# Altium project HTPCB.PrjPcb
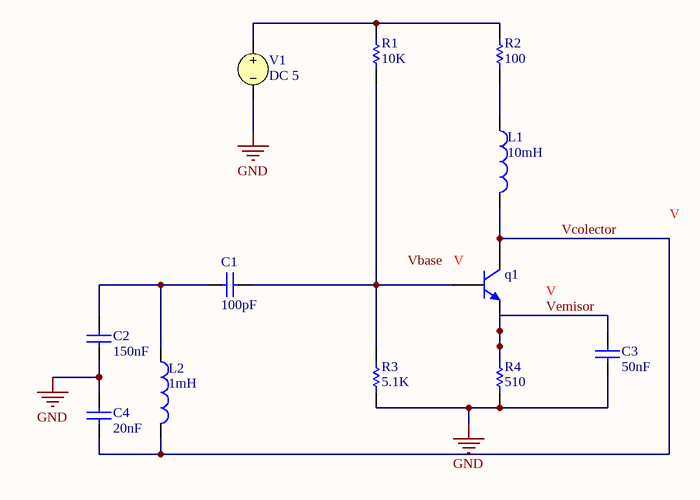
[diagram p0: DC.SchDoc]
Author: Diego Terraza; Carnet: 21601; Curso: IE3028; Revision: 1.0
13 sheets, 88 parts. Net scope: global (net labels, ports and power ports of the same name join across sheets).
Board file: Pruebapcb.PcbDoc
Sheets:
  DC.SchDoc
  Transitorio.SchDoc
  HTDC.SchDoc
  HTtransitorio.SchDoc
  HTparametros.SchDoc
  Barrido_1fuente.SchDoc
  Barrido2fuentes.SchDoc
  AnalisisAC.SchDoc
  FourierHT.SchDoc
  WorstCaseHT.SchDoc
  Barridotemp.SchDoc
  polosyzeros.SchDoc
  Pruebaesquem.SchDoc

## Sheet DC.SchDoc
size Letter; Author: Diego Terraza; Revision: 1.0; SheetNumber: 1; SheetTotal: 2; Curso: IE3028; Carnet: 21601

### Parts
C1  value 100pF  (hidden comment: Capacitor)
C2  value 150nF  (hidden comment: Capacitor)
C3  value 50nF  (hidden comment: Capacitor)
C4  value 20nF  (hidden comment: Capacitor)
L1  value 10mH  (hidden comment: Inductor)
L2  value 1mH  (hidden comment: Inductor)
q1  Bipolar NPN 3 Pins Transistor VBIC Model  (value not drawn)
R1  value 10K  (hidden comment: Resistor)
R2  value 100  (hidden comment: Resistor)
R3  value 5.1K  (hidden comment: Resistor)
R4  value 510  (hidden comment: Resistor)
V1  DC 5

### Nets
GND: C2.2 C3.2 C4.1 R3.2 R4.2 V1.2
Vcolector: C4.2 L1.2 L2.2 q1.1(C)
Vemisor: C3.1 q1.3(E) R4.1
NetC1_1: C1.1 q1.2(B) R1.2 R3.1
NetC1_2: C1.2 C2.1 L2.1
NetL1_1: L1.1 R2.2
NetR1_1: R1.1 R2.1 V1.1

### Notes on the sheet
- Labels drawn without touching a wire or pin: Vbase
- Text
- Proyecto:
- Documento:
- Autor:
- Carnet:
- Fecha:
- Revisión:
- Curso:
- Tamaño:
- Hoja:
- de
- Carta

### Library data of the parts
C1-C4 = Capacitor: SimulationGenericComponent: True
L1 L2 = Inductor: SimulationGenericComponent: True
q1 = BJT NPN VBIC: SimulationGenericComponent: True; AFN: 1; AJC: -0.5; ART: 0.1; AVC1: 0; EA: 1.12; FC: 0.9; IBBE: 1e-06; IBCI: 1e-16; IBEI: 1e-18; MC: 0.33; NCN: 2; NKF: 0.5; PC: 0.75; TNOM: 27; VERS: 1.2; XII: 3; AJE: -0.5; AJS: -0.5; AVC2: 0; BFN: 1; CBCO: 0; CBEO: 0; CCSO: 0; CJC: 0; CJCP: 0; CJE: 0; CJEP: 0; CTH: 0; DEAR: 0; EAIC: 1.12; EAIE: 1.12; EAIS: 1.12; EANC: 1.12; EANE: 1.12; EANS: 1.12; EAP: 1.12; EBBE: 0; GAMM: 0; HRCF: 1; IBCIP: 0; IBCN: 0; IBCNP: 0; IBEIP: 0; IBEN: 0; IBENP: 0; IKF: 0; IKP: 0; IKR: 0; IS: 1e-16; ISP: 0; ISRR: 1; ITF: 0; KFN: 0; ME: 0.33; MS: 0.33; NBBE: 1; NCI: 1; NCIP: 1; NCNP: 2; NEI: 1; NEN: 2; NF: 1; NFP: 1; NR: 1; PE: 0.75; PS: 0.75; QBM: 0; QCO: 0; QTF: 0; RBI: 0.1; RBP: 0.1; RBX: 0; RCI: 0.1; RCX: 0; RE: 0; RS: 0; RTH: 0; TAVC: 0; TD: 0; TF: 0; TNBBE: 0; TNF: 0; TR: 0; TVBBE1: 0; TVBBE2: 0; VBBE: 0; VEF: 0; VER: 0; VO: 0; VREF: 0; VRT: 0; VTF: 0; WBE: 1; WSP: 1; XIKF: 0; XIN: 3; XIS: 3; XISR: 0; XRBI: 0; XRBP: 0; XRBX: 0; XRCI: 0; XRCX: 0; XRE: 0; XRS: 0; XTF: 0; XVO: 0
R1-R4 = Resistor: TC1: 0; SimulationGenericComponent: True; TC2: 0
V1 = VSRC: Voltage Source; Note: PCB Footprint - Not required; AC Magnitude: 1; AC Phase: 0; Value: 5; Published: 8-Jun-2000; LatestRevisionDate: 17-Jul-2002; LatestRevisionNote: Re-released for DXP Platform.; PackageReference: Not Applicable; Publisher: Altium Limited

## Sheet Transitorio.SchDoc
size Letter; SheetNumber: 2; SheetTotal: 4
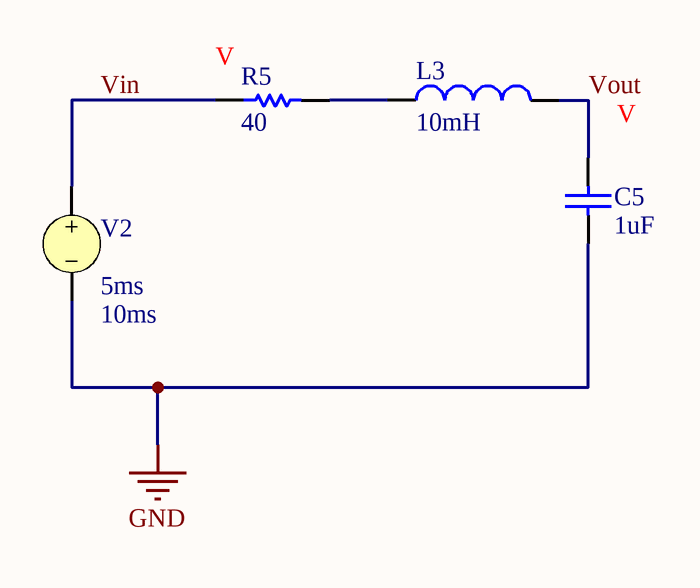
[diagram p1: Transitorio.SchDoc]

### Parts
C5  value 1uF  (hidden comment: Capacitor)
L3  value 10mH  (hidden comment: Inductor)
R5  value 40  (hidden comment: Resistor)
V2  Pulse Width: 5ms  Period: 10ms  (hidden comment: PULSE(0 1 100n 10n 10n 5ms 10ms 0))

### Nets
GND: C5.1 V2.2
Vin: R5.1 V2.1
Vout: C5.2 L3.2
NetL3_1: L3.1 R5.2

### Notes on the sheet
- Proyecto:
- Documento:
- Autor:
- Carnet:
- Fecha:
- Revisión:
- Curso:
- Tamaño:
- Hoja:
- de
- Carta

### Library data of the parts
C5 = Capacitor: SimulationGenericComponent: True
L3 = Inductor: SimulationGenericComponent: True
R5 = Resistor: TC1: 0; SimulationGenericComponent: True; TC2: 0
V2 = VSRC: Voltage Source; Note: PCB Footprint - Not required; AC Magnitude: 1; AC Phase: 0; Published: 8-Jun-2000; LatestRevisionDate: 17-Jul-2002; LatestRevisionNote: Re-released for DXP Platform.; PackageReference: Not Applicable; Publisher: Altium Limited; DC Magnitude: 1; Initial Value: 0; Pulsed Value: 1; Time Delay: 100n; Rise Time: 10n; Fall Time: 10n; Phase: 0

## Sheet HTDC.SchDoc
size Letter; SheetNumber: 3; SheetTotal: 3
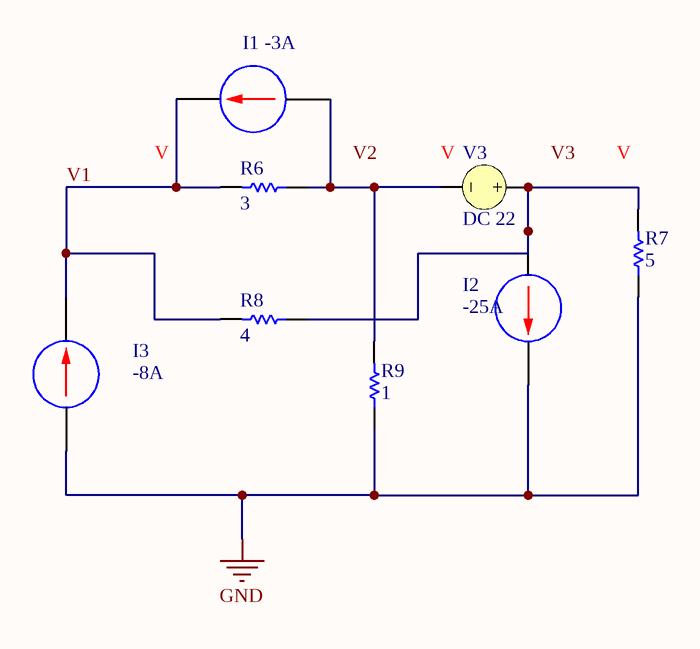
[diagram p2: HTDC.SchDoc]

### Parts
I1  DC: -3A  (hidden comment: DC Current Source)
I2  DC: -25A  (hidden comment: DC Current Source)
I3  DC: -8A  (hidden comment: DC Current Source)
R6  value 3  (hidden comment: Resistor)
R7  value 5  (hidden comment: Resistor)
R8  value 4  (hidden comment: Resistor)
R9  value 1  (hidden comment: Resistor)
V3  DC 22

### Nets
GND: I2.1(+) I3.2(-) R7.1 R9.1
V1: I1.1(+) I3.1(+) R6.2 R8.2
NetI1_2: I1.2(-) R6.1 R9.2 V3.2
NetI2_2: I2.2(-) R7.2 R8.1 V3.1

### Notes on the sheet
- Labels drawn without touching a wire or pin: V2, V3
- Proyecto:
- Documento:
- Autor:
- Carnet:
- Fecha:
- Revisión:
- Curso:
- Tamaño:
- Hoja:
- de
- Carta

### Library data of the parts
I1-I3 = DC Current Source: SimulationGenericComponent: True
R6-R9 = Resistor: TC1: 0; SimulationGenericComponent: True; TC2: 0
V3 = VSRC: Voltage Source; Note: PCB Footprint - Not required; AC Magnitude: 1; AC Phase: 0; Value: 22; Published: 8-Jun-2000; LatestRevisionDate: 17-Jul-2002; LatestRevisionNote: Re-released for DXP Platform.; PackageReference: Not Applicable; Publisher: Altium Limited

## Sheet HTtransitorio.SchDoc
size Letter; SheetNumber: 4; SheetTotal: 4
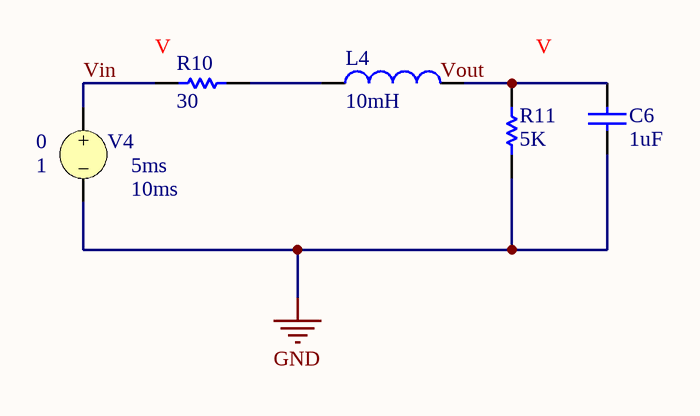
[diagram p3: HTtransitorio.SchDoc]

### Parts
C6  value 1uF  (hidden comment: Capacitor)
L4  value 10mH  (hidden comment: Inductor)
R10  value 30  (hidden comment: Resistor)
R11  value 5K  (hidden comment: Resistor)
V4  Initial Value: 0  Pulsed Value: 1  Pulse Width: 5ms  Period: 10ms  (hidden comment: PULSE(0 1 100n 10n 10n 5ms 10ms 0))

### Nets
GND: C6.1 R11.2 V4.2
Vin: R10.2 V4.1
NetC6_2: C6.2 L4.2 R11.1
NetL4_1: L4.1 R10.1

### Notes on the sheet
- Labels drawn without touching a wire or pin: Vout
- Proyecto:
- Documento:
- Autor:
- Carnet:
- Fecha:
- Revisión:
- Curso:
- Tamaño:
- Hoja:
- de
- Carta

### Library data of the parts
C6 = Capacitor: SimulationGenericComponent: True
L4 = Inductor: SimulationGenericComponent: True
R10 R11 = Resistor: TC1: 0; SimulationGenericComponent: True; TC2: 0
V4 = VSRC: Voltage Source; Note: PCB Footprint - Not required; DC Magnitude: 5; Published: 8-Jun-2000; LatestRevisionDate: 17-Jul-2002; LatestRevisionNote: Re-released for DXP Platform.; PackageReference: Not Applicable; Publisher: Altium Limited; AC Magnitude: 1; AC Phase: 0; Time Delay: 100n; Rise Time: 10n; Fall Time: 10n; Phase: 0

## Sheet HTparametros.SchDoc
size Letter; SheetNumber: 5; SheetTotal: 5
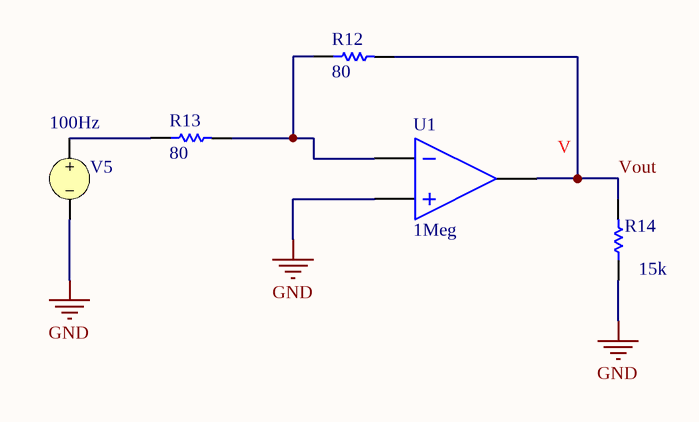
[diagram p4: HTparametros.SchDoc]

### Parts
R12  value 80  (hidden comment: Resistor)
R13  value 80  (hidden comment: Resistor)
R14  value 15k  (hidden comment: Resistor)
U1  GAIN: 1Meg  (hidden comment: Ideal Operational Amplifier)
V5  Frequency: 100Hz  (hidden comment: SIN(0 1 100Hz 0 0 0))

### Nets
GND: R14.1 U1.2(IN+) V5.2
Vout: R12.2 R14.2 U1.3(OUT)
NetR12_1: R12.1 R13.2 U1.1(IN-)
NetR13_1: R13.1 V5.1

### Notes on the sheet
- Proyecto:
- Documento:
- Autor:
- Carnet:
- Fecha:
- Revisión:
- Curso:
- Tamaño:
- Hoja:
- de
- Carta

### Library data of the parts
R12-R14 = Resistor: TC1: 0; SimulationGenericComponent: True; TC2: 0
U1 = OpAmp: SimulationGenericComponent: True
V5 = VSRC: Voltage Source; Note: PCB Footprint - Not required; AC Magnitude: 1; AC Phase: 0; DC Magnitude: 5; Published: 8-Jun-2000; LatestRevisionDate: 17-Jul-2002; LatestRevisionNote: Re-released for DXP Platform.; PackageReference: Not Applicable; Publisher: Altium Limited; Offset: 0; Delay: 0; Damping Factor: 0; Phase: 0; Amplitude: 1

## Sheet Barrido_1fuente.SchDoc
size A4; SheetNumber: 6; SheetTotal: 6
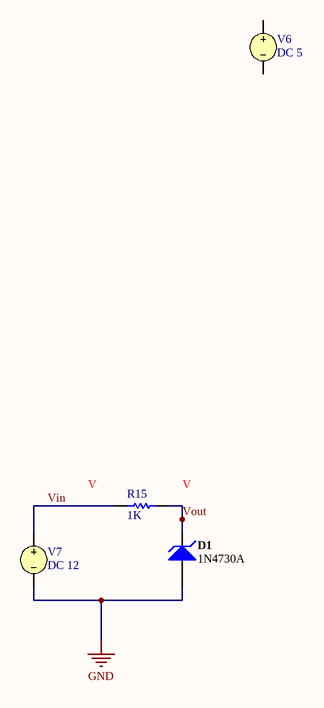
[diagram p5: Barrido_1fuente.SchDoc]

### Parts
D1  1N4730A  [FAIR-DO-41-2_V]
R15  value 1K  (hidden comment: Resistor)
V6  DC 5
V7  DC 12

### Nets
GND: D1.1(A) V7.2
Vin: R15.1 V7.1
Vout: D1.2(K) R15.2

Not connected (* = marked no-connect by the designer): V6 1 2

### Library data of the parts
D1 = CMP-0892-00029-1: Zener Diode, 3.9V, 1W, 5%, -65 to 200 degC, 2-Pin DO-41, Body 2.72 x 5.2 mm, RoHS; Manufacturer: Fairchild Semiconductor; Test Current IZ (mA): 64; ZZ (Max) (ohm): 9; IR (uA): 50; VZ (Min.) (V): 3.705; VZ (Max.) (V): 4.095; PD (W): 1; ComponentLink2Description: Datasheet; Operating and Storage Temperature Range: -65 to 200 degC; DatasheetVersion: Rev. H3; PackageReference: DO-41-2; ComponentLink3Description: Package Specification; RoHS: TRUE; PackageVersion: Rev. 2; PartNumber: 1N4730A; ComponentLink2URL: http://www.fairchildsemi.com/ds/1N/1N4744A.pdf; Tolerance: 5%; ComponentLink1Description: Manufacturer URL; ComponentLink1URL: http://www.fairchildsemi.com/; Mounting Technology: Through Hole; ComponentLink3URL: http://www.fairchildsemi.com/dwg/DO/DO41A.pdf; PackageDescription: 2-Pin Axial leaded, Body 2.72 x 5.2 mm, Lead Spread 25.4 mm
R15 = Resistor: TC1: 0; SimulationGenericComponent: True; TC2: 0
V6 = VSRC: as V1 on sheet DC; Published: 8-Jun-2000; LatestRevisionDate: 17-Jul-2002; LatestRevisionNote: Re-released for DXP Platform.; PackageReference: Not Applicable; Publisher: Altium Limited
V7 = VSRC: Voltage Source; Note: PCB Footprint - Not required; AC Magnitude: 1; AC Phase: 0; Value: 12; Published: 8-Jun-2000; LatestRevisionDate: 17-Jul-2002; LatestRevisionNote: Re-released for DXP Platform.; PackageReference: Not Applicable; Publisher: Altium Limited

## Sheet Barrido2fuentes.SchDoc
size A4; SheetNumber: 7; SheetTotal: 7
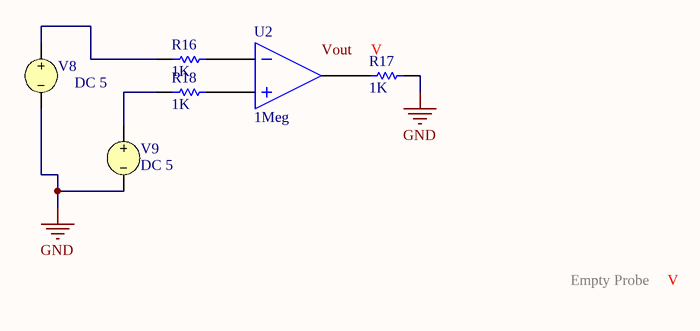
[diagram p6: Barrido2fuentes.SchDoc]

### Parts
R16  value 1K  (hidden comment: Resistor)
R17  value 1K  (hidden comment: Resistor)
R18  value 1K  (hidden comment: Resistor)
U2  GAIN: 1Meg  (hidden comment: Ideal Operational Amplifier)
V8  DC 5
V9  DC 5

### Nets
GND: R17.2 V8.2 V9.2
NetR16_1: R16.1 V8.1
NetR16_2: R16.2 U2.1(IN-)
NetR17_1: R17.1 U2.3(OUT)
NetR18_1: R18.1 V9.1
NetR18_2: R18.2 U2.2(IN+)

### Notes on the sheet
- Labels drawn without touching a wire or pin: Vout

### Library data of the parts
R16-R18 = Resistor: TC1: 0; SimulationGenericComponent: True; TC2: 0
U2 = OpAmp: SimulationGenericComponent: True
V8 V9 = VSRC: as V1 on sheet DC; Published: 8-Jun-2000; LatestRevisionDate: 17-Jul-2002; LatestRevisionNote: Re-released for DXP Platform.; PackageReference: Not Applicable; Publisher: Altium Limited

## Sheet AnalisisAC.SchDoc
size A4; SheetNumber: 8; SheetTotal: 8
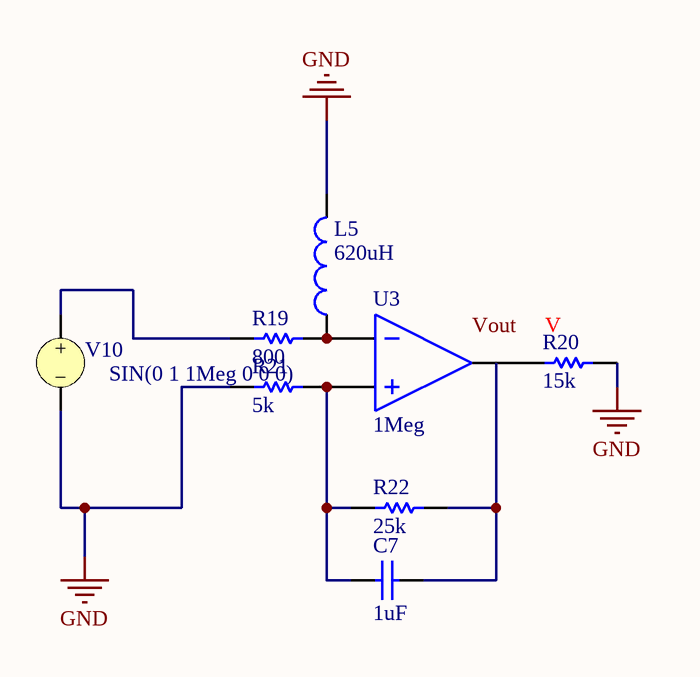
[diagram p7: AnalisisAC.SchDoc]

### Parts
C7  value 1uF  (hidden comment: Capacitor)
L5  value 620uH  (hidden comment: Inductor)
R19  value 800  (hidden comment: Resistor)
R20  value 15k  (hidden comment: Resistor)
R21  value 5k  (hidden comment: Resistor)
R22  value 25k  (hidden comment: Resistor)
U3  GAIN: 1Meg  (hidden comment: Ideal Operational Amplifier)
V10  SIN(0 1 1Meg 0 0 0)

### Nets
GND: L5.2 R20.2 R21.1 V10.2
NetC7_1: C7.1 R22.2
NetC7_2: C7.2 R21.2 R22.1 U3.2(IN+)
NetL5_1: L5.1 R19.2 U3.1(IN-)
NetR19_1: R19.1 V10.1
NetR20_1: R20.1 U3.3(OUT)

### Notes on the sheet
- Labels drawn without touching a wire or pin: Vout

### Library data of the parts
C7 = Capacitor: SimulationGenericComponent: True
L5 = Inductor: SimulationGenericComponent: True
R19-R22 = Resistor: TC1: 0; SimulationGenericComponent: True; TC2: 0
U3 = OpAmp: SimulationGenericComponent: True
V10 = VSRC: as V5 on sheet HTparametros; Published: 8-Jun-2000; LatestRevisionDate: 17-Jul-2002; LatestRevisionNote: Re-released for DXP Platform.; PackageReference: Not Applicable; Publisher: Altium Limited; Offset: 0; Amplitude: 1; Frequency: 1Meg; Delay: 0; Damping Factor: 0; Phase: 0

## Sheet FourierHT.SchDoc
size A4; SheetNumber: 9; SheetTotal: 9
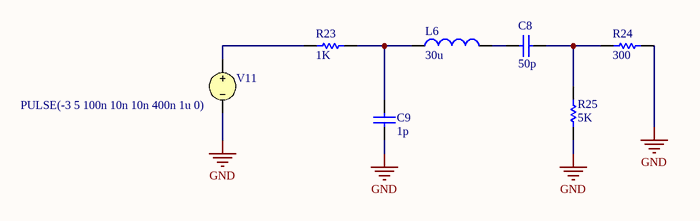
[diagram p8: FourierHT.SchDoc]

### Parts
C8  value 50p  (hidden comment: Capacitor)
C9  value 1p  (hidden comment: Capacitor)
L6  value 30u  (hidden comment: Inductor)
R23  value 1K  (hidden comment: Resistor)
R24  value 300  (hidden comment: Resistor)
R25  value 5K  (hidden comment: Resistor)
V11  PULSE(-3 5 100n 10n 10n 400n 1u 0)

### Nets
GND: C9.1 R24.2 R25.1 V11.2
NetC8_1: C8.1 R24.1 R25.2
NetC8_2: C8.2 L6.2
NetC9_2: C9.2 L6.1 R23.2
NetR23_1: R23.1 V11.1

### Library data of the parts
C8 C9 = Capacitor: SimulationGenericComponent: True
L6 = Inductor: SimulationGenericComponent: True
R23-R25 = Resistor: TC1: 0; SimulationGenericComponent: True; TC2: 0
V11 = VSRC: as V5 on sheet HTparametros; Published: 8-Jun-2000; LatestRevisionDate: 17-Jul-2002; LatestRevisionNote: Re-released for DXP Platform.; PackageReference: Not Applicable; Publisher: Altium Limited; Initial Value: -3; Pulsed Value: 5; Time Delay: 100n; Rise Time: 10n; Fall Time: 10n; Pulse Width: 400n; Period: 1u; Phase: 0

## Sheet WorstCaseHT.SchDoc
size A4; SheetNumber: 10; SheetTotal: 10
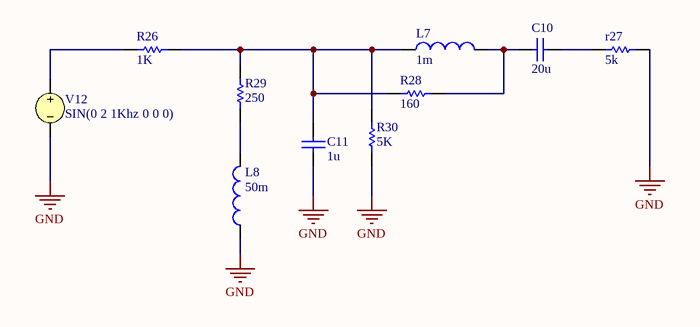
[diagram p9: WorstCaseHT.SchDoc]

### Parts
C10  value 20u  (hidden comment: Capacitor)
C11  value 1u  (hidden comment: Capacitor)
L7  value 1m  (hidden comment: Inductor)
L8  value 50m  (hidden comment: Inductor)
R26  value 1K  (hidden comment: Resistor)
r27  value 5k  (hidden comment: Resistor)
R28  value 160  (hidden comment: Resistor)
R29  value 250  (hidden comment: Resistor)
R30  value 5K  (hidden comment: Resistor)
V12  SIN(0 2 1Khz 0 0 0)

### Nets
GND: C11.1 L8.1 r27.1 R30.1 V12.2
NetC10_1: C10.1 r27.2
NetC10_2: C10.2 L7.2 R28.1
NetC11_2: C11.2 L7.1 R26.2 R28.2 R29.2 R30.2
NetL8_2: L8.2 R29.1
NetR26_1: R26.1 V12.1

### Library data of the parts
C10 C11 = Capacitor: SimulationGenericComponent: True
L7 L8 = Inductor: SimulationGenericComponent: True
R26 r27 R28-R30 = Resistor: TC1: 0; SimulationGenericComponent: True; TC2: 0
V12 = VSRC: Voltage Source; Note: PCB Footprint - Not required; AC Magnitude: 1; AC Phase: 0; DC Magnitude: 5; Amplitude: 2; Published: 8-Jun-2000; LatestRevisionDate: 17-Jul-2002; LatestRevisionNote: Re-released for DXP Platform.; PackageReference: Not Applicable; Publisher: Altium Limited; Offset: 0; Frequency: 1Khz; Delay: 0; Damping Factor: 0; Phase: 0

## Sheet Barridotemp.SchDoc
size A4; SheetNumber: 11; SheetTotal: 11
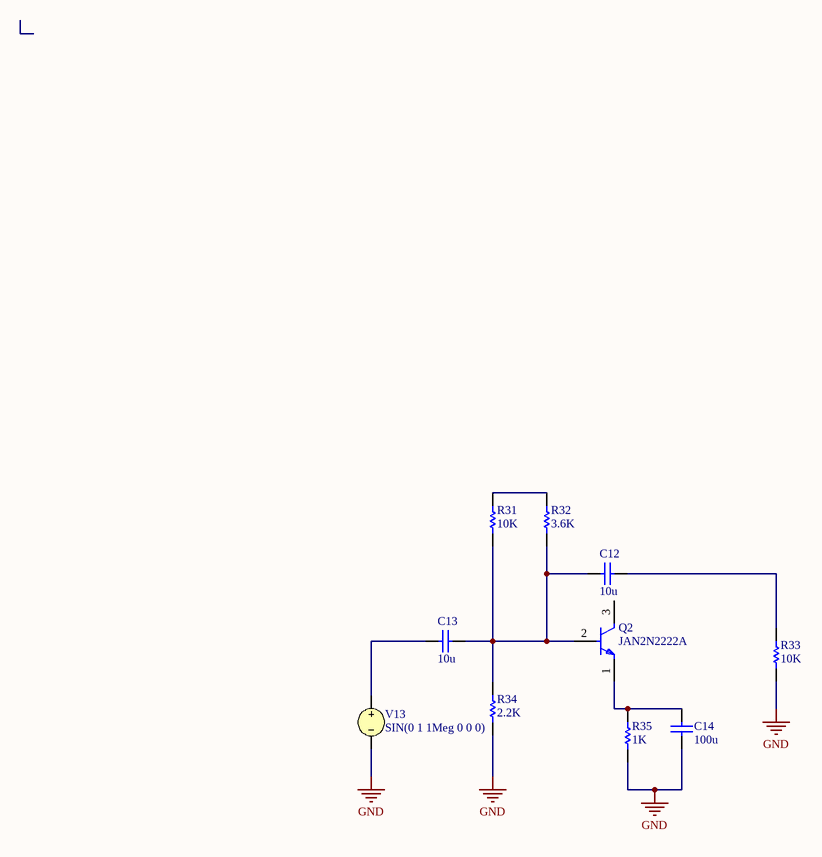
[diagram p10: Barridotemp.SchDoc]

### Parts
C12  value 10u  (hidden comment: Capacitor)
C13  value 10u  (hidden comment: Capacitor)
C14  value 100u  (hidden comment: Capacitor)
Q2  JAN2N2222A  [FP-JAN2N2222A-MFG]
R31  value 10K  (hidden comment: Resistor)
R32  value 3.6K  (hidden comment: Resistor)
R33  value 10K  (hidden comment: Resistor)
R34  value 2.2K  (hidden comment: Resistor)
R35  value 1K  (hidden comment: Resistor)
V13  SIN(0 1 1Meg 0 0 0)

### Nets
GND: C14.1 R33.1 R34.1 R35.1 V13.2
NetC12_1: C12.1 C13.2 Q2.2(B) R31.1 R32.1 R34.2
NetC12_2: C12.2 R33.2
NetC13_1: C13.1 V13.1
NetC14_2: C14.2 Q2.1(E) R35.2
NetR31_2: R31.2 R32.2

Not connected (* = marked no-connect by the designer): Q2 3(C)

### Library data of the parts
C12-C14 = Capacitor: SimulationGenericComponent: True
Q2 = CMP-06366-000013-1: TRANS NPN 50V 0.8A TO218
R31-R35 = Resistor: TC1: 0; SimulationGenericComponent: True; TC2: 0
V13 = VSRC: as V5 on sheet HTparametros; Published: 8-Jun-2000; LatestRevisionDate: 17-Jul-2002; LatestRevisionNote: Re-released for DXP Platform.; PackageReference: Not Applicable; Publisher: Altium Limited; Offset: 0; Amplitude: 1; Frequency: 1Meg; Delay: 0; Damping Factor: 0; Phase: 0

## Sheet polosyzeros.SchDoc
size A4; SheetNumber: 12; SheetTotal: 12
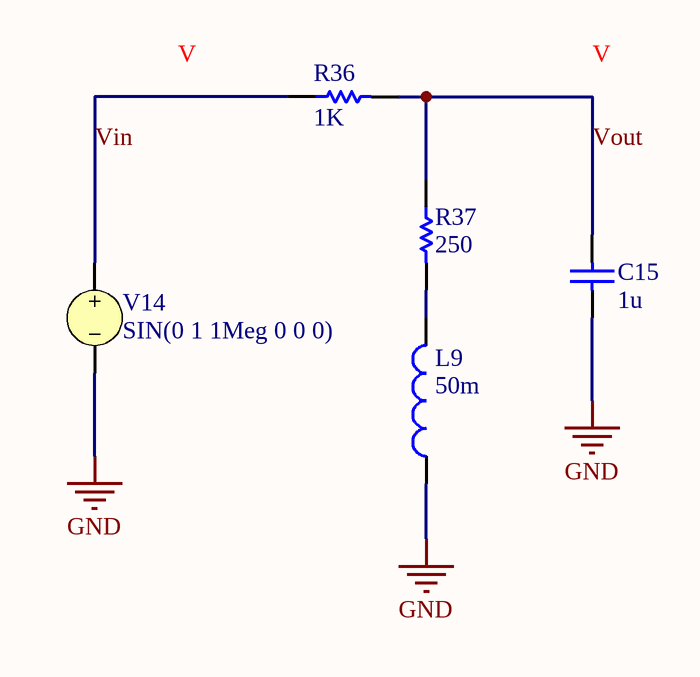
[diagram p11: polosyzeros.SchDoc]

### Parts
C15  value 1u  (hidden comment: Capacitor)
L9  value 50m  (hidden comment: Inductor)
R36  value 1K  (hidden comment: Resistor)
R37  value 250  (hidden comment: Resistor)
V14  SIN(0 1 1Meg 0 0 0)

### Nets
GND: C15.1 L9.1 V14.2
Vin: R36.1 V14.1
Vout: C15.2 R36.2 R37.1
NetL9_2: L9.2 R37.2

### Library data of the parts
C15 = Capacitor: SimulationGenericComponent: True
L9 = Inductor: SimulationGenericComponent: True
R36 R37 = Resistor: TC1: 0; SimulationGenericComponent: True; TC2: 0
V14 = VSRC: as V5 on sheet HTparametros; Published: 8-Jun-2000; LatestRevisionDate: 17-Jul-2002; LatestRevisionNote: Re-released for DXP Platform.; PackageReference: Not Applicable; Publisher: Altium Limited; Offset: 0; Amplitude: 1; Frequency: 1Meg; Delay: 0; Damping Factor: 0; Phase: 0

## Sheet Pruebaesquem.SchDoc
size A4; SheetNumber: 13; SheetTotal: 13
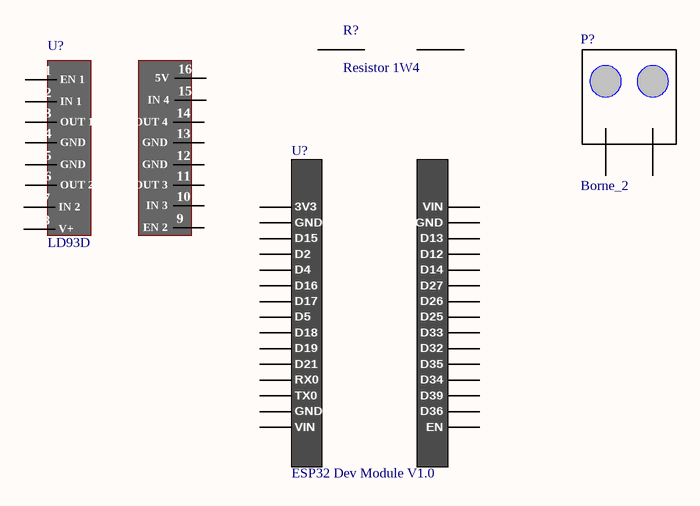
[diagram p12: Pruebaesquem.SchDoc]

### Parts
(Parts that share a designator on the sheet are numbered #1, #2 ... from top to bottom, then left to right.)
P?  Borne_2  [PCBComponent_1]
R?  Resistor 1W4  [PCBComponent_1]
U?#1  LD93D  [PCBComponent_1]
U?#2  ESP32 Dev Module V1.0  [ESP32 Dev Kit V1.0]

### Nets

Not connected (* = marked no-connect by the designer): P? 1 2; R? 1 2; U?#1 1(EN_1) 2(IN_1) 3(OUT_1) 4(GND) 5(GND) 6(OUT_2) 7(IN_2) 8(V+) 9(EN_2) 10(IN_3) 11(OUT_3) 12(GND) 13(GND) 14(OUT_4) 15(IN_4) 16(5V); U?#2 1(3V3) 2(GND) 3(D15) 4(D2) 5(D4) 6(D16) 7(D17) 8(D5) 9(D18) 10(D19) 11(D21) 12(RX0) 13(TX0) 14(GND) 15(VIN) 16(EN) 17(D36) 18(D39) 19(D34) 20(D35) 21(D32) 22(D33) 23(D25) 24(D26) 25(D27) 26(D14) 27(D12) 28(D13) 29(GND) 30(VIN)

### Library data of the parts
P? = Borne_2: Borne de dos pines
U?#1 = LD93D: THT DIP 16
U?#2 = ESP32 Dev Module V.1: Development kit V1.0, ESP32-D0WD-V3, ESP32 ECO V3, 4 MB SPI flash, PCB antenna; Manufacturer: Espressif Systems; Manufacturer Part Number: ESP32-WROOM-32E(M113EH3200PH3Q0); Supplier: Digi-Key; Supplier Part Number: 1965-ESP32-WROOM-32E-N4TR-ND; RoHS: No; Category: RF Receivers, Transceivers; Pricing: 650=2.5 (USD)

## Nets that join several sheets
GND: DC (6 pins), Transitorio (C5.1 V2.2), HTDC (I2.1 I3.2 R7.1 R9.1), HTtransitorio (C6.1 R11.2 V4.2), HTparametros (R14.1 U1.2 V5.2), Barrido_1fuente (D1.1 V7.2), Barrido2fuentes (R17.2 V8.2 V9.2), AnalisisAC (L5.2 R20.2 R21.1 V10.2), FourierHT (C9.1 R24.2 R25.1 V11.2), WorstCaseHT (5 pins), Barridotemp (5 pins), polosyzeros (C15.1 L9.1 V14.2)
Vin: Transitorio (R5.1 V2.1), HTtransitorio (R10.2 V4.1), Barrido_1fuente (R15.1 V7.1), polosyzeros (R36.1 V14.1)
Vout: Transitorio (C5.2 L3.2), HTparametros (R12.2 R14.2 U1.3), Barrido_1fuente (D1.2 R15.2), polosyzeros (C15.2 R36.2 R37.1)